# EasyEDA schematic SOS_receiver.json
TITLE: Sheet_1; REV: 1.0; Date: 2026-02-24; Sheet: 1/1; Drawn By: ザカリアサイッド; Company: Your Company
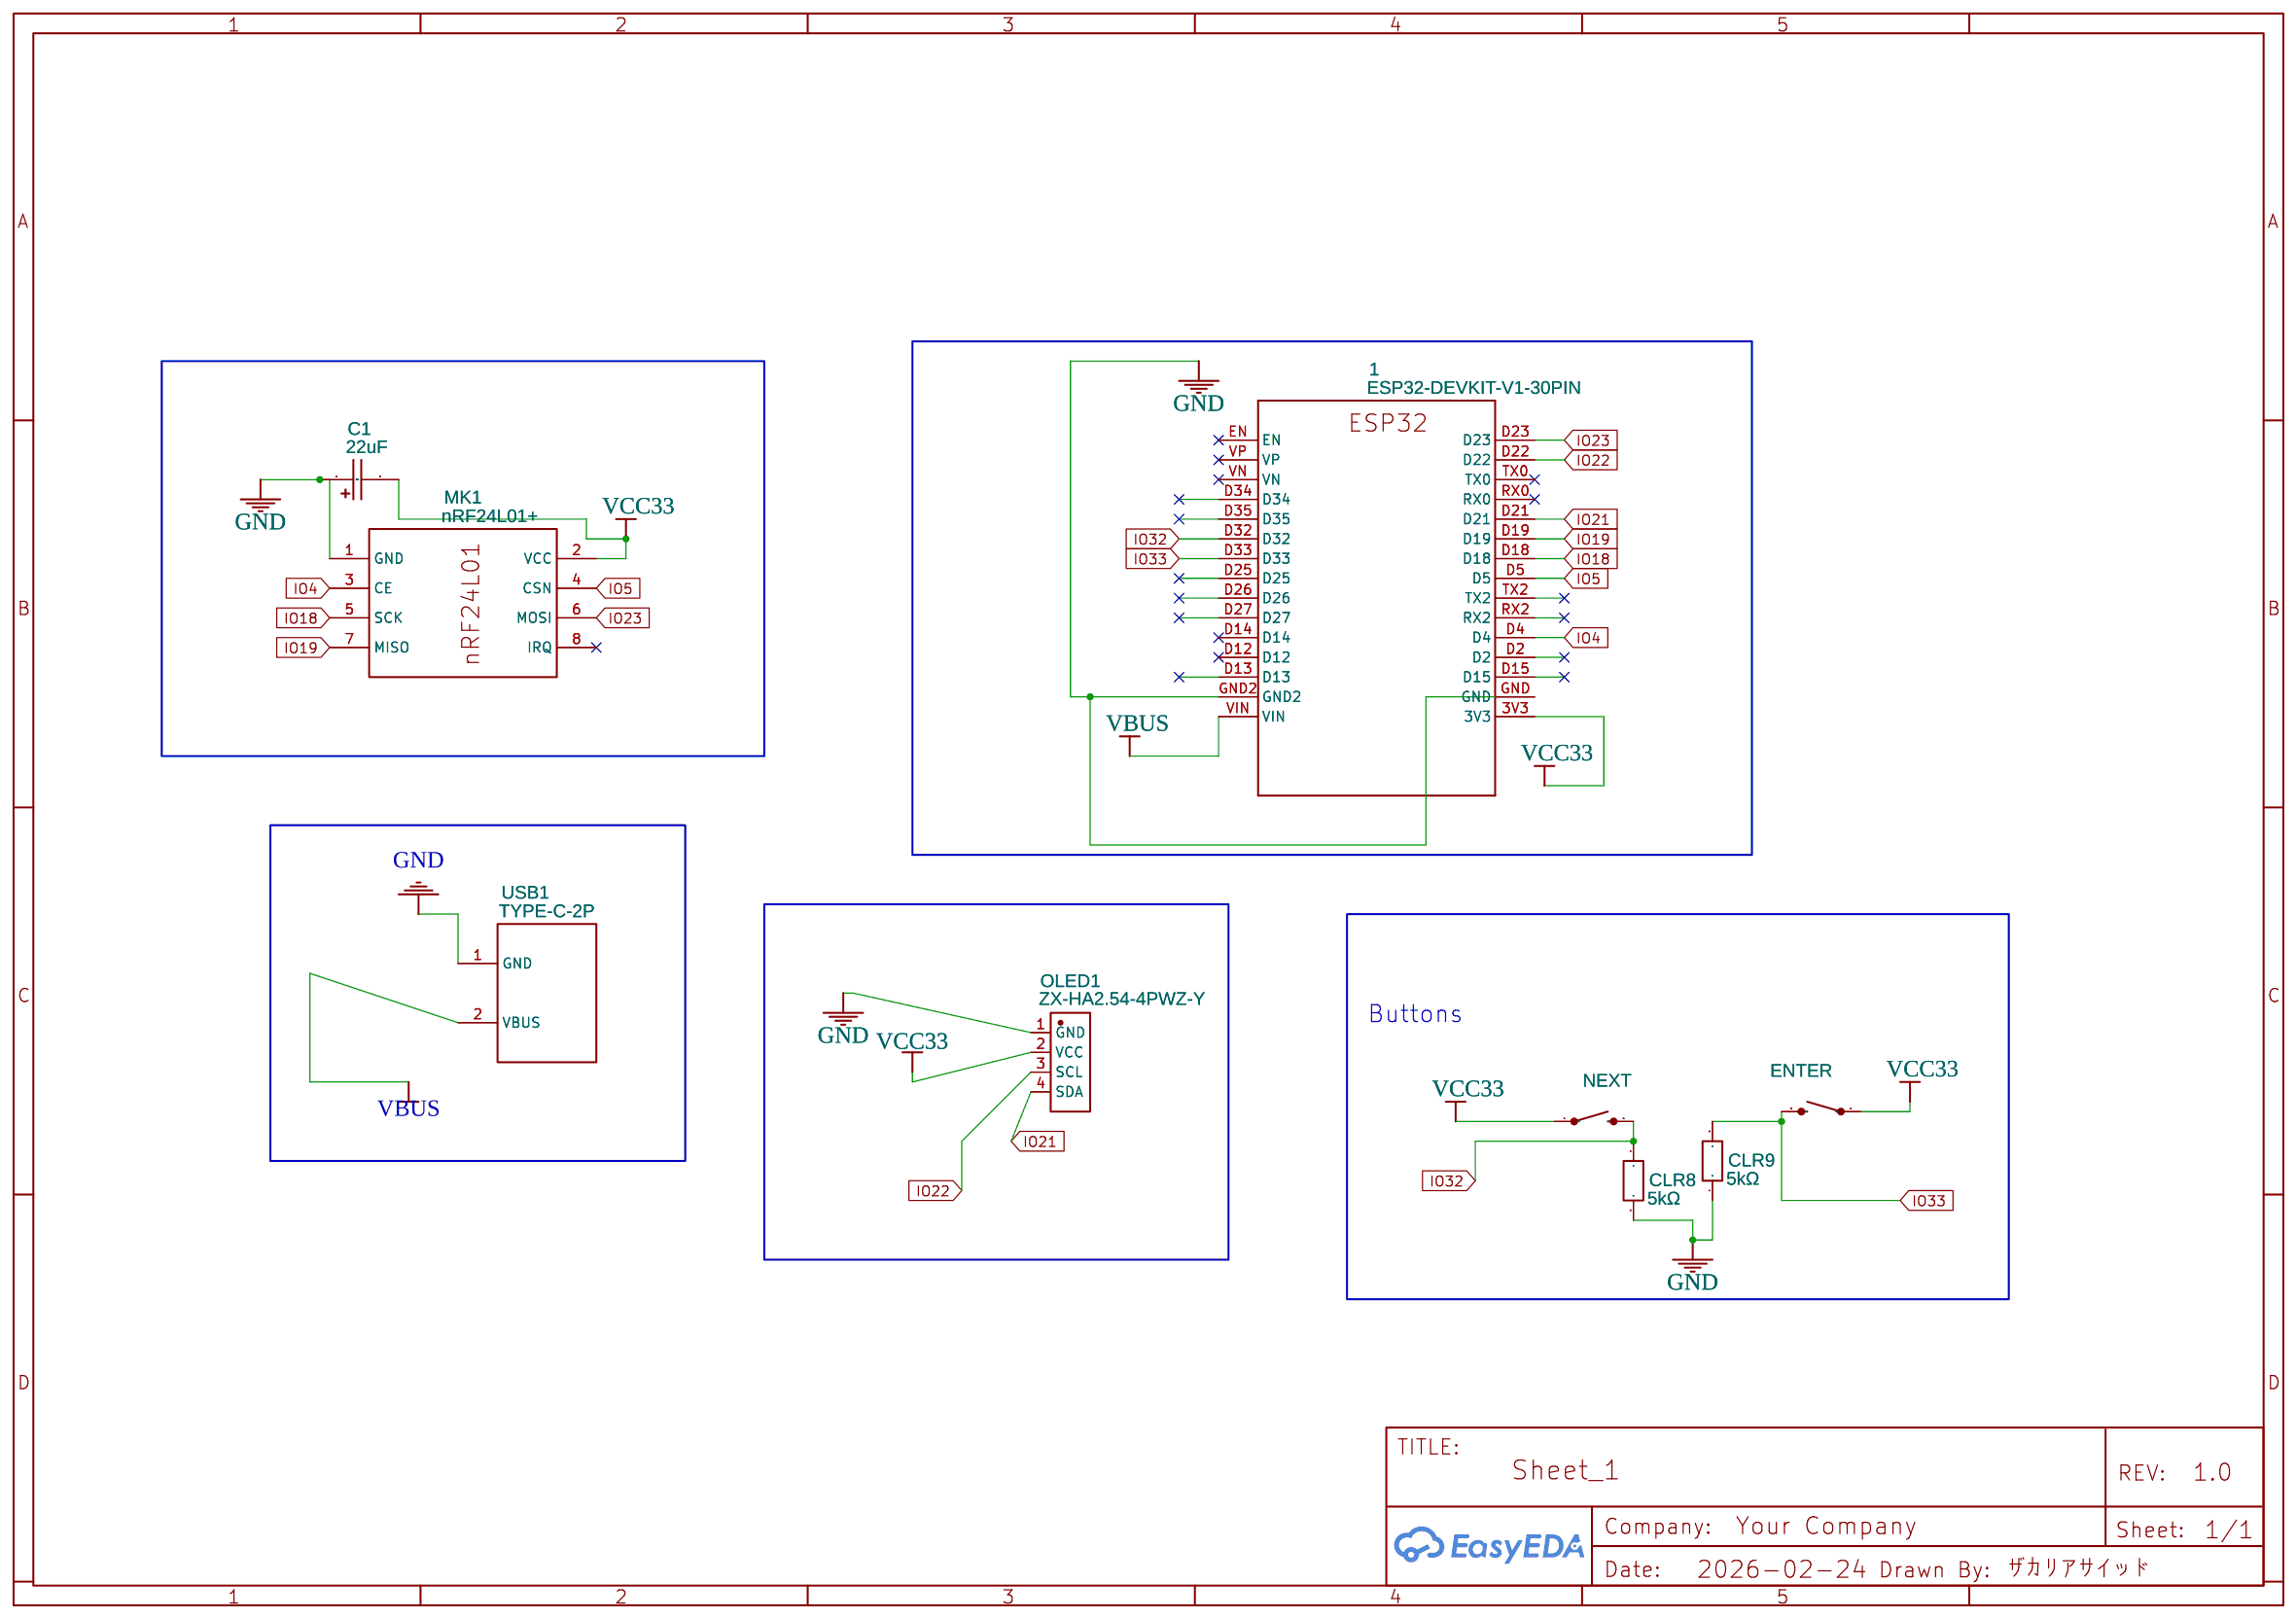
[diagram p0: schematic sheet]

## Parts
1  ESP32-DEVKIT-V1-30PIN  [ESP32-DEVKITV1_ESP32-DEVKITV1]
C1  22uF  [22UF_16V]
CLR8  5kΩ  [1/4 WATT MF RESITOR V3]
CLR9  5kΩ  [1/4 WATT MF RESITOR V3]
ENTER  SWITCHES_PTH_EZ  [TACTILE-PTH-EZ]
MK1  nRF24L01+  [NRF24L01]
NEXT  SWITCHES_PTH_EZ  [TACTILE-PTH-EZ]
OLED1  ZX-HA2.54-4PWZ-Y  [CONN-TH_ZX-HA2.54-4PWZ-Y]
USB1  TYPE-C-2P  [TYPE-C-2P]

## Library data of the parts
1 = ESP32-DEVKIT-V1-30PIN: Contributor: KiraKira san
C1 = 22uF_16V: Contributor: LCSC; Supplier: LCSC; Supplier Part: C1579587; Manufacturer: Nichicon; Manufacturer Part: UES1V220MPM1TD; JLCPCB Part Class: Extended Part; Link: https://www.lcsc.com/product-detail/Aluminum-Electrolytic-Capacitors-Leaded_Nichicon-UES1V220MPM1TD_C1579587.html
CLR8 CLR9 = R_AXIAL-0.4_EU: Contributor: bpgraphics; Package Display: No
ENTER NEXT = SWITCHES_PTH_EZ: Various NO switches- pushbuttons, reed, etc; Contributor: Dman771
MK1 = nRF24L01+: Contributor: marek.stafl
OLED1 = ZX-HA2.54-4PWZ-Y: Supplier: LCSC; Supplier Part: C22388701; Manufacturer: Megastar(兆星); JLCPCB Part Class: Extended Part; Contributor: lcsc
USB1 = TYPE-C-2P: Contributor: alxm

## Nets
GND: 1.GND 1.GND2 C1.1 CLR8.2 CLR9.1 MK1.1(GND) OLED1.1(GND) USB1.1(GND)
VBUS: 1.VIN USB1.2(VBUS)
VCC33: 1.3V3 C1.2 ENTER.1 MK1.2(VCC) NEXT.1 OLED1.2(VCC)
IO4: 1.D4 MK1.3(CE)
IO5: 1.D5 MK1.4(CSN)
IO18: 1.D18 MK1.5(SCK)
IO19: 1.D19 MK1.7(MISO)
IO21: 1.D21 OLED1.4(SDA)
IO22: 1.D22 OLED1.3(SCL)
IO23: 1.D23 MK1.6(MOSI)
IO32: 1.D32 CLR8.1 NEXT.3(2)
IO33: 1.D33 CLR9.2 ENTER.3(2)

Not connected (* = marked no-connect by the designer): 1 D2 D12* D13 D14* D15 D25 D26 D27 D34 D35 EN* RX0* RX2 TX0* TX2 VN* VP*; MK1 8(IRQ)*

## Notes on the sheet
- Buttons
